# Altium schematic sheet Main.SchDoc
size 190 x 162 mm; PageSetup: Record=PageOptions|CenterHorizontal=True|CenterVertical=True|PrintScale=1.00|XCorrection=1.00|YCorrection=1.00|PrintKind=0|BorderSize=5000000|LeftOffset=0|BottomOffset=0|Orientation=2|PaperLength=1000|PaperWidth=1000|Scale=100|PaperSource=7|PrintQuality=-3|MediaType=1|DitherType=10|PrintScaleMode=0|PaperKind=A4|PaperIndex=9
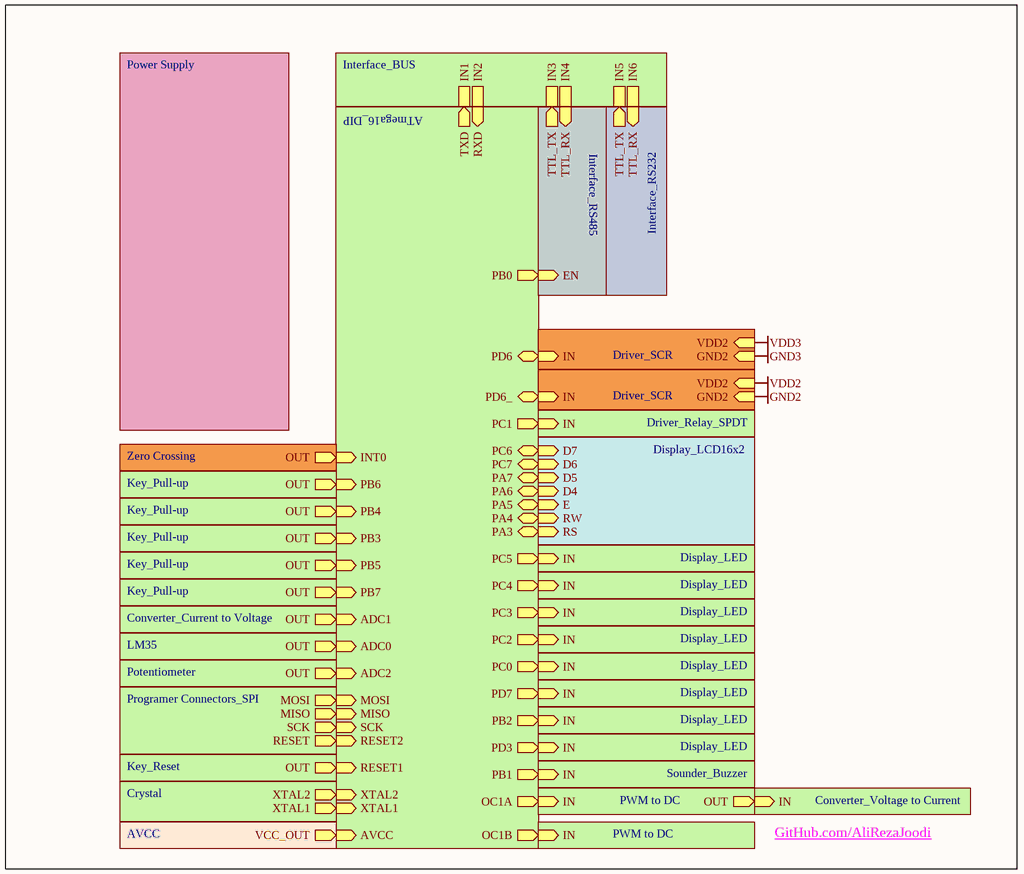
[diagram p0: Main.SchDoc]

## Sub-sheets
U_ATmega16_DIP = ATmega16_DIP: AVCC (in), XTAL2 (in), XTAL1 (in), RESET1 (in), RESET2 (in), SCK (in), MISO (in), MOSI (in), ADC0 (in), ADC1 (in), ADC2 (in), INT0 (in), OC1A (out), OC1B (out), TXD (out), RXD (in), PB0 (out), PB1 (out), PC6, PC7, PA7, PA6, PA5, PA4, PA3, PC5 (out), PD6, PD6_, PD3 (out), PD7 (out), PC0 (out), PC1 (out), PC2 (out), PC3 (out), PC4 (out), PB2 (out), PB6 (in), PB5 (in), PB4 (in), PB3 (in), PB7 (in)
U_AVCC = AVCC: VCC_OUT (out)
U_Converter_Current to Voltage = Converter_Current to Voltage: OUT (out)
U_Converter_Voltage to Current = Converter_Voltage to Current: IN (in)
U_Crystal = Crystal: XTAL2 (out), XTAL1 (out)
U_Display_LCD16x2 = Display_LCD16x2: D7 (in), D6 (in), D5 (in), D4 (in), E (in), RW (in), RS (in)
U_Display_LED = Display_LED: IN (in)
U_Display_LED = Display_LED: IN (in)
U_Display_LED = Display_LED: IN (in)
U_Display_LED = Display_LED: IN (in)
U_Display_LED = Display_LED: IN (in)
U_Display_LED = Display_LED: IN (in)
U_Display_LED = Display_LED: IN (in)
U_Display_LED = Display_LED: IN (in)
U_Driver_Relay_SPDT = Driver_Relay_SPDT: IN (in)
U_Driver_SCR = Driver_SCR: IN (in), VDD2 (in), GND2 (in)
U_Driver_SCR = Driver_SCR: IN (in), VDD2 (in), GND2 (in)
U_Interface_BUS = Interface_BUS: IN1, IN2, IN3, IN4, IN5, IN6
U_Interface_RS232 = Interface_RS232: TTL_RX (in), TTL_TX (out)
U_Interface_RS485 = Interface_RS485: TTL_RX (in), EN (in), TTL_TX (out)
U_Key_Pull-up = Key_Pull-up: OUT (out)
U_Key_Pull-up = Key_Pull-up: OUT (out)
U_Key_Pull-up = Key_Pull-up: OUT (out)
U_Key_Pull-up = Key_Pull-up: OUT (out)
U_Key_Pull-up = Key_Pull-up: OUT (out)
U_Key_Reset = Key_Reset: OUT (out)
U_LM35 = LM35: OUT (out)
U_Potentiometer = Potentiometer: OUT (out)
U_Power Supply = Power Supply: no entries
U_Programer Connectors_SPI = Programer Connectors_SPI: RESET (out), SCK (out), MISO (out), MOSI (out)
U_PWM to DC = PWM to DC: IN (in)
U_PWM to DC = PWM to DC: IN (in), OUT (out)
U_Sounder_Buzzer = Sounder_Buzzer: IN (in)
U_Zero Crossing = Zero Crossing: OUT (out)

## Nets
GND2: sheet U_Driver_SCR/GND2
GND3: sheet U_Driver_SCR/GND2
VDD2: sheet U_Driver_SCR/VDD2
VDD3: sheet U_Driver_SCR/VDD2
(unnamed): sheet U_ATmega16_DIP/AVCC, sheet U_AVCC/VCC_OUT
(unnamed): sheet U_ATmega16_DIP/XTAL2, sheet U_Crystal/XTAL2
(unnamed): sheet U_ATmega16_DIP/XTAL1, sheet U_Crystal/XTAL1
(unnamed): sheet U_ATmega16_DIP/RESET1, sheet U_Key_Reset/OUT
(unnamed): sheet U_ATmega16_DIP/RESET2, sheet U_Programer Connectors_SPI/RESET
(unnamed): sheet U_ATmega16_DIP/SCK, sheet U_Programer Connectors_SPI/SCK
(unnamed): sheet U_ATmega16_DIP/MISO, sheet U_Programer Connectors_SPI/MISO
(unnamed): sheet U_ATmega16_DIP/MOSI, sheet U_Programer Connectors_SPI/MOSI
(unnamed): sheet U_ATmega16_DIP/ADC0, sheet U_LM35/OUT
(unnamed): sheet U_ATmega16_DIP/ADC1, sheet U_Converter_Current to Voltage/OUT
(unnamed): sheet U_ATmega16_DIP/ADC2, sheet U_Potentiometer/OUT
(unnamed): sheet U_ATmega16_DIP/INT0, sheet U_Zero Crossing/OUT
(unnamed): sheet U_ATmega16_DIP/OC1A, sheet U_PWM to DC/IN
(unnamed): sheet U_ATmega16_DIP/OC1B, sheet U_PWM to DC/IN
(unnamed): sheet U_ATmega16_DIP/TXD, sheet U_Interface_BUS/IN1
(unnamed): sheet U_ATmega16_DIP/RXD, sheet U_Interface_BUS/IN2
(unnamed): sheet U_ATmega16_DIP/PB0, sheet U_Interface_RS485/EN
(unnamed): sheet U_ATmega16_DIP/PB1, sheet U_Sounder_Buzzer/IN
(unnamed): sheet U_ATmega16_DIP/PC6, sheet U_Display_LCD16x2/D7
(unnamed): sheet U_ATmega16_DIP/PC7, sheet U_Display_LCD16x2/D6
(unnamed): sheet U_ATmega16_DIP/PA7, sheet U_Display_LCD16x2/D5
(unnamed): sheet U_ATmega16_DIP/PA6, sheet U_Display_LCD16x2/D4
(unnamed): sheet U_ATmega16_DIP/PA5, sheet U_Display_LCD16x2/E
(unnamed): sheet U_ATmega16_DIP/PA4, sheet U_Display_LCD16x2/RW
(unnamed): sheet U_ATmega16_DIP/PA3, sheet U_Display_LCD16x2/RS
(unnamed): sheet U_ATmega16_DIP/PC5, sheet U_Display_LED/IN
(unnamed): sheet U_ATmega16_DIP/PD6, sheet U_Driver_SCR/IN
(unnamed): sheet U_ATmega16_DIP/PD6_, sheet U_Driver_SCR/IN
(unnamed): sheet U_ATmega16_DIP/PD3, sheet U_Display_LED/IN
(unnamed): sheet U_ATmega16_DIP/PD7, sheet U_Display_LED/IN
(unnamed): sheet U_ATmega16_DIP/PC0, sheet U_Display_LED/IN
(unnamed): sheet U_ATmega16_DIP/PC1, sheet U_Driver_Relay_SPDT/IN
(unnamed): sheet U_ATmega16_DIP/PC2, sheet U_Display_LED/IN
(unnamed): sheet U_ATmega16_DIP/PC3, sheet U_Display_LED/IN
(unnamed): sheet U_ATmega16_DIP/PC4, sheet U_Display_LED/IN
(unnamed): sheet U_ATmega16_DIP/PB2, sheet U_Display_LED/IN
(unnamed): sheet U_ATmega16_DIP/PB6, sheet U_Key_Pull-up/OUT
(unnamed): sheet U_ATmega16_DIP/PB5, sheet U_Key_Pull-up/OUT
(unnamed): sheet U_ATmega16_DIP/PB4, sheet U_Key_Pull-up/OUT
(unnamed): sheet U_ATmega16_DIP/PB3, sheet U_Key_Pull-up/OUT
(unnamed): sheet U_ATmega16_DIP/PB7, sheet U_Key_Pull-up/OUT
(unnamed): sheet U_Converter_Voltage to Current/IN, sheet U_PWM to DC/OUT
(unnamed): sheet U_Interface_BUS/IN3, sheet U_Interface_RS485/TTL_TX
(unnamed): sheet U_Interface_BUS/IN4, sheet U_Interface_RS485/TTL_RX
(unnamed): sheet U_Interface_BUS/IN5, sheet U_Interface_RS232/TTL_TX
(unnamed): sheet U_Interface_BUS/IN6, sheet U_Interface_RS232/TTL_RX

## Notes on the sheet
- GitHub.com/AliRezaJoodi